# EAGLE design NinjaPool-1J-171004 (EAGLE 6.6.0)
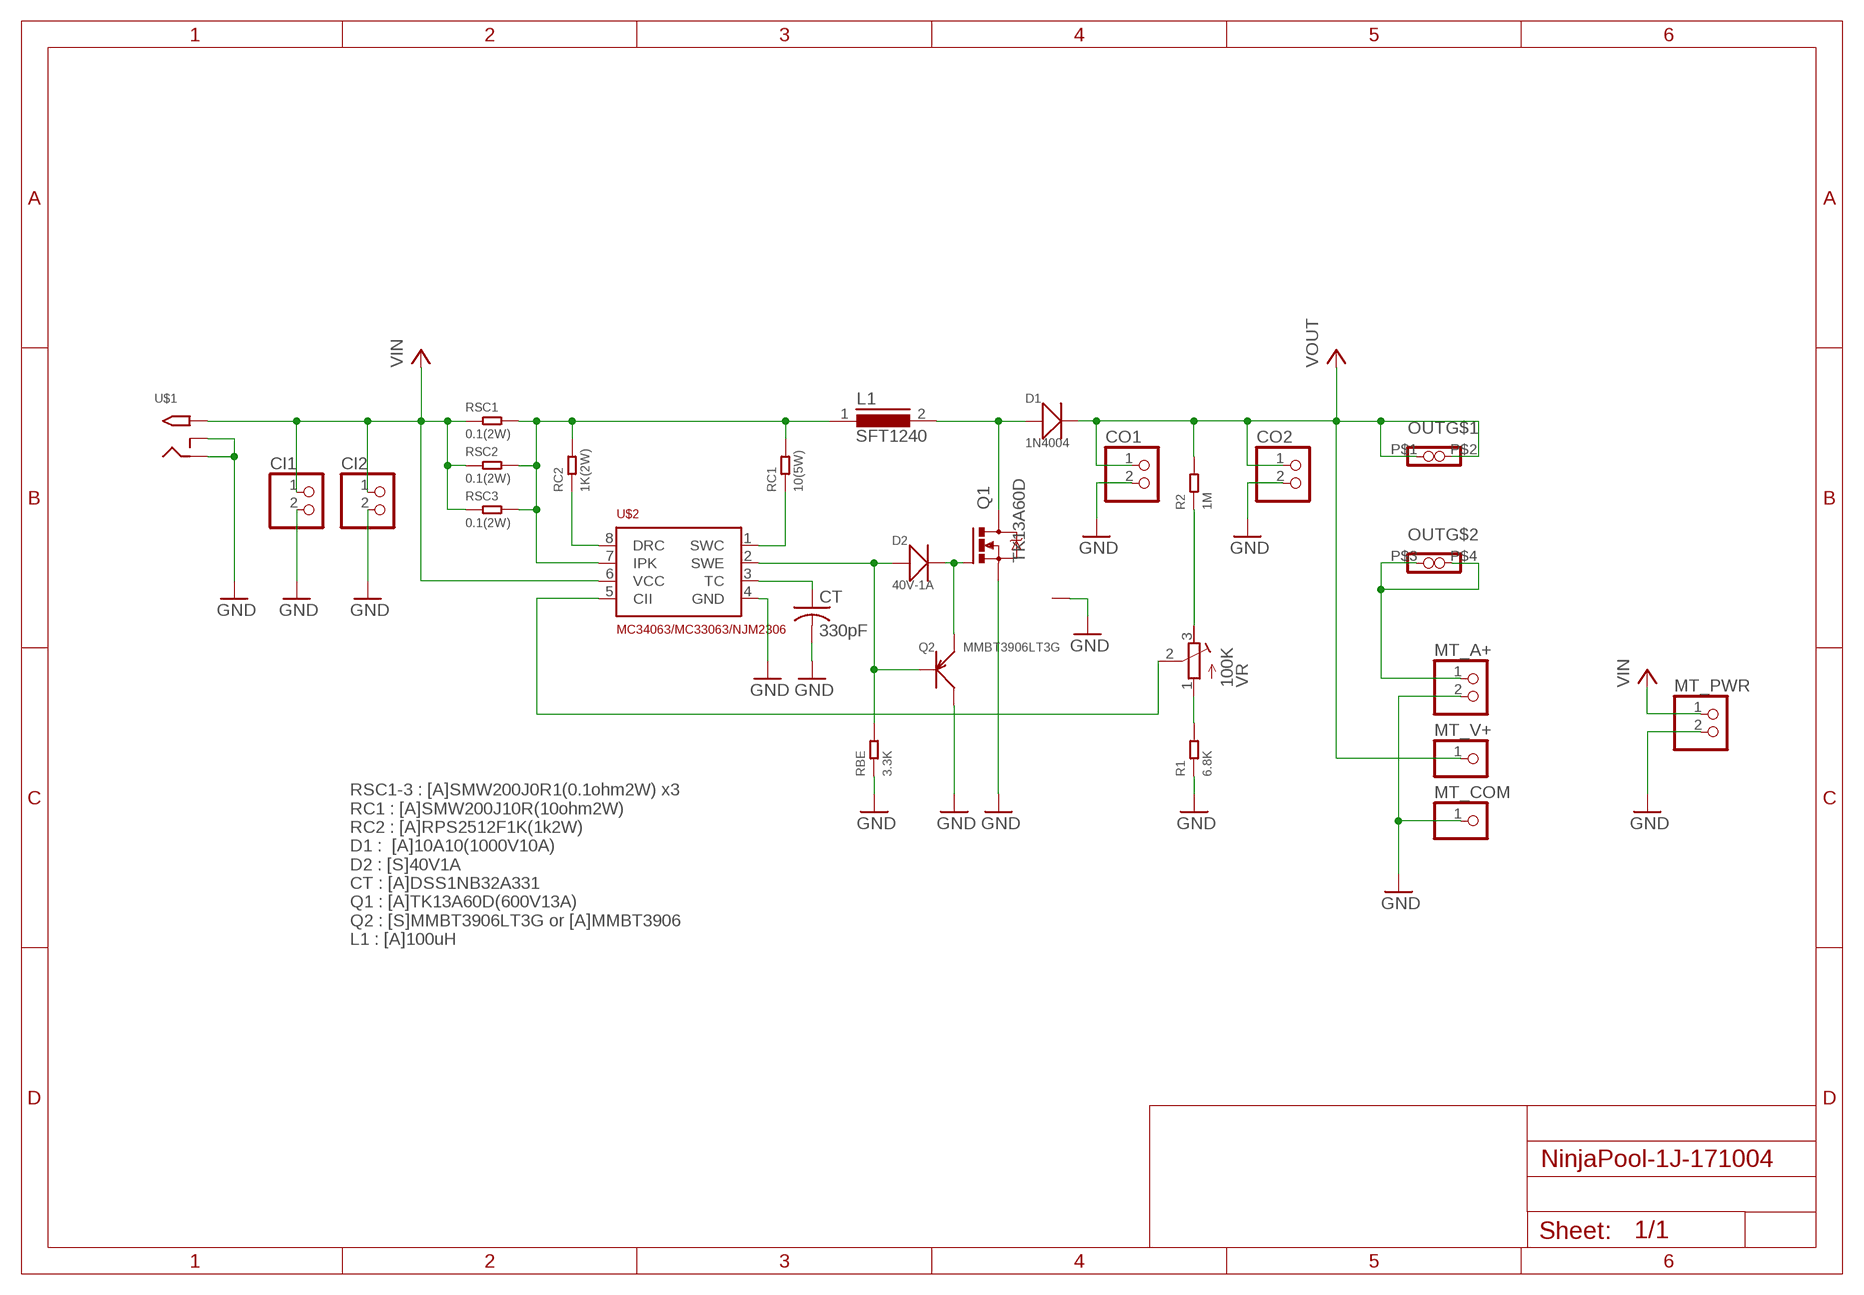
[diagram p0: schematic, sheet 1]

## Parts
CI1  PINHD-1X2  [1X02]
CI2  PINHD-1X2  [1X02]
CO1  PINHD-1X2  [1X02]
CO2  PINHD-1X2  [1X02]
CT  330pF  C-US050-024X044  [C050-024X044]
D1  1N4004  DIP-DIODE-400V-1A(DO-41)  [DO-41]
D2  40V-1A  SMD-DIODE-SCHOTTKY-40V-1A(DO-214AC)  [DO-214AC]
HEAT  HEAT111PB015  [HEAT11PB015]
L1  SFT1240  [SFT1240]
MT_A+  PINHD-1X2  [1X02]
MT_COM  PINHD-1X1  [1X01]
MT_PWR  PINHD-1X2  [1X02]
MT_V+  PINHD-1X1  [1X01]
OUT  BANANA  [BANANA_TMP]
Q1  TK13A60D  IRF520  [TO220BV]
Q2  MMBT3906LT3G  SMD-TRANSISTORS-PNP-40V-200MA-MMBT3906LT3G(SOT-23)  [SOT-23]
R1  6.8K  SMD-RES-6.8K-1%-1/10W(0603)  [R0603]
R2  1M  SMD-RES-1M-1%-1/10W(0603)  [R0603]
RBE  3.3K  SMD-RES-3.3K-5%-1/10W(0603)  [R0603]
RC1  10(5W)  SWE500  [SWE500]
RC2  1K(2W)  R2512  [R2512]
RSC1  0.1(2W)  SWE200  [SMW200]
RSC2  0.1(2W)  SWE200  [SMW200]
RSC3  0.1(2W)  SWE200  [SMW200]
U$1  2.1MMJACKTHM  [PJ-102A]
U$2  MC34063/MC33063/NJM2306  [DIL8]
VR  100K  R-TRIMMAITENDO_R16K1  [AITENDO_R16K1]

## Nets
A+: MT_A+.1 OUT.P$3 OUT.P$4
GND: CI1.2 CI2.2 CO1.2 CO2.2 CT.2 HEAT.P$1 MT_A+.2 MT_COM.1 MT_PWR.2 Q1.S Q2.3(C) R1.1 RBE.1 U$1.RING U$1.RING_SW U$2.4(GND)
LIN: L1.1 RC1.2 RC2.2 RSC1.2 RSC2.2 RSC3.2 U$2.7(IPK)
N$1: R2.1 VR.3(E)
N$2: RC2.1 U$2.8(DRC)
N$3: RC1.1 U$2.1(SWC)
N$4: CT.1 U$2.3(TC)
N$7: R1.2 VR.1(A)
N$8: U$2.5(CII) VR.2(S)
Q1_DRAIN: D1.1(+) L1.2 Q1.D
Q1_GATE_Q2_COLLECT: D2.2(-) Q1.G Q2.2(E)
Q2_BASE: D2.1(+) Q2.1(B) RBE.2 U$2.2(SWE)
VIN: CI1.1 CI2.1 MT_PWR.1 RSC1.1 RSC2.1 RSC3.1 U$1.TIP U$2.6(VCC)
VOUT: CO1.1 CO2.1 D1.2(-) MT_V+.1 OUT.P$1 OUT.P$2 R2.2

## Notes on the sheet
- RSC1-3 : [A]SMW200J0R1(0.1ohm2W) x3
  RC1 : [A]SMW200J10R(10ohm2W)
  RC2 : [A]RPS2512F1K(1k2W)
  D1 :  [A]10A10(1000V10A)
  D2 : [S]40V1A
  CT : [A]DSS1NB32A331
  Q1 : [A]TK13A60D(600V13A)
  Q2 : [S]MMBT3906LT3G or [A]MMBT3906
  L1 : [A]100uH

## Library data of the parts
CI1 CI2 CO1 CO2 MT_A+ MT_PWR = pinhead:PINHD-1X2: PIN HEADER
CT = rcl:C-US: CAPACITOR, American symbol
D1 = Seeed-Diode:DIP-DIODE-400V-1A(DO-41): 304010008; MPN: 1N4004
D2 = Seeed-Diode:SMD-DIODE-SCHOTTKY-40V-1A(DO-214AC): 304020027; MPN: 1N5819
HEAT = PCR-Connector:HEAT1
L1 = inductors:SFT1240: INDUCTOR
MT_COM MT_V+ = pinhead:PINHD-1X1: PIN HEADER
OUT = PCR-Connector:BANANA
Q1 = transistor-power:IRF520: HEXFET Power MOSFET
Q2 = Seeed-Transistor:SMD-TRANSISTORS-PNP-40V-200MA-MMBT3906LT3G(SOT-23): 305020002; MPN: MMBT3906LT3G
R1 = Seeed-Resistor:SMD-RES-6.8K-1%-1/10W(0603): 301010198; MPN: RC0805JR-07220KL
R2 = Seeed-Resistor:SMD-RES-1M-1%-1/10W(0603): 301010151; MPN: RC0603FR-071ML
RBE = Seeed-Resistor:SMD-RES-3.3K-5%-1/10W(0603): 301010112
RC1 RSC1-RSC3 = PCR-RCL:SWE
RC2 = PCR-RCL:R
U$1 = adafruit:2.1MMJACK: 2.1mm x 5.5mm THM DC jack with internal switch. Digikey part #PJ-102A, 4UCON part #05537 2.1mm x 5.5mm SMT DC jack with internal switch. Digikey part #PJ-002A-SMT, 4UCON part #03267 By microbuilder.eu & adafruit.com
U$2 = PCR-IC:MC34063/MC33063/NJM2306
VR = PCR-RCL:R-TRIMM

## Board
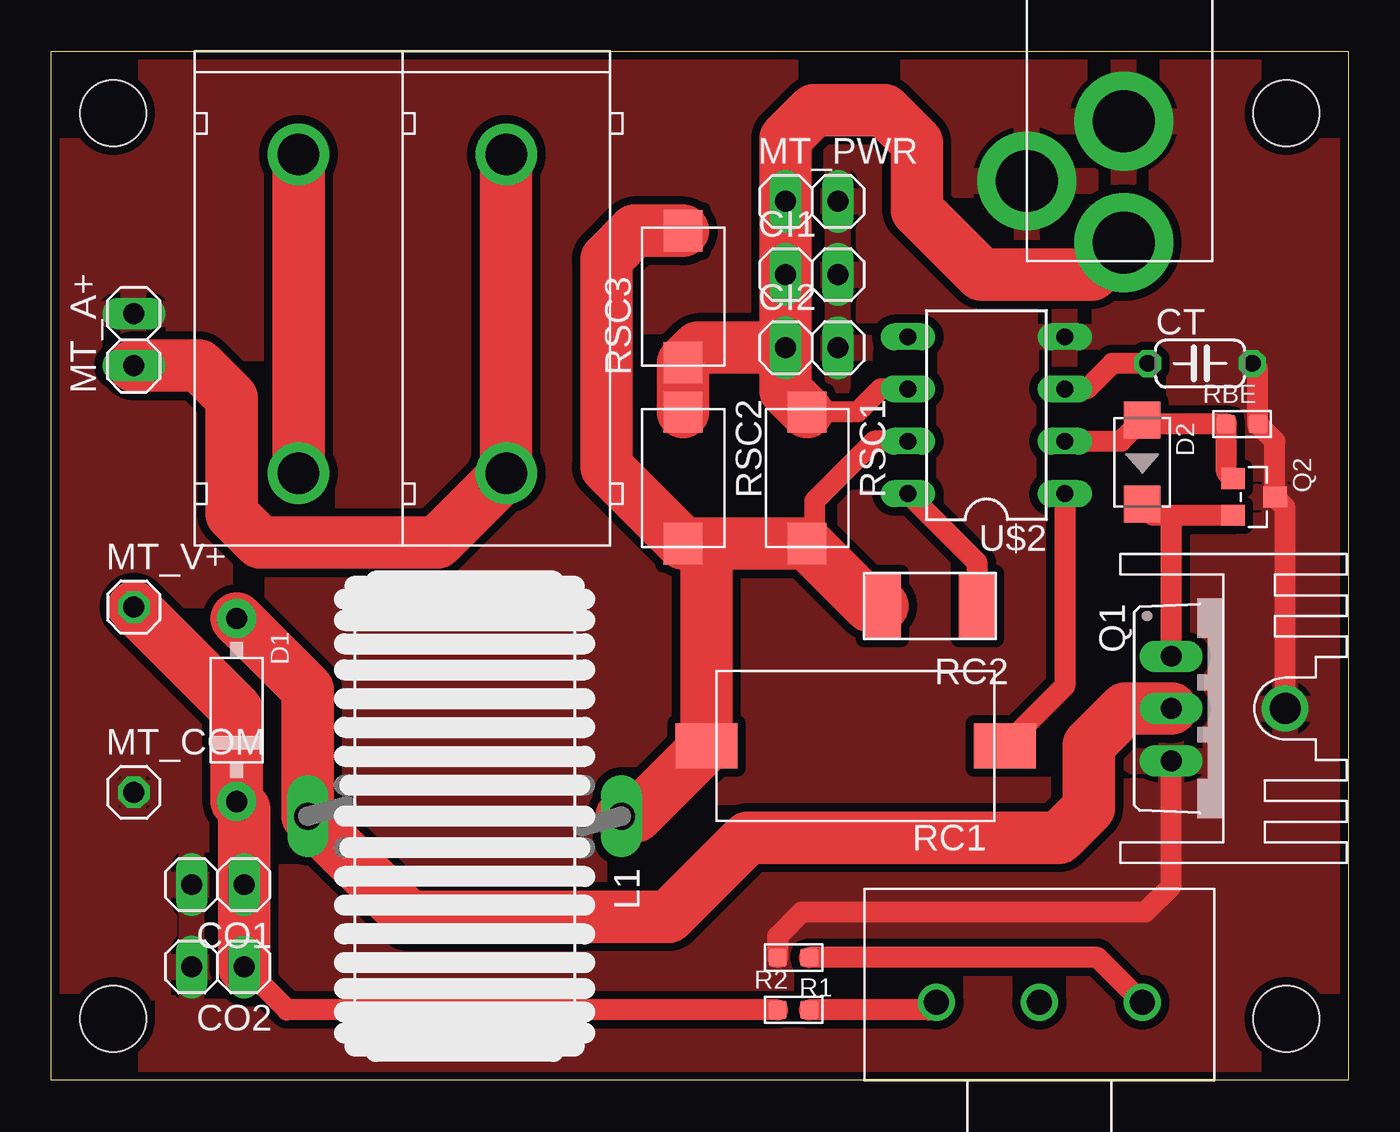
[diagram p1: board, top side]
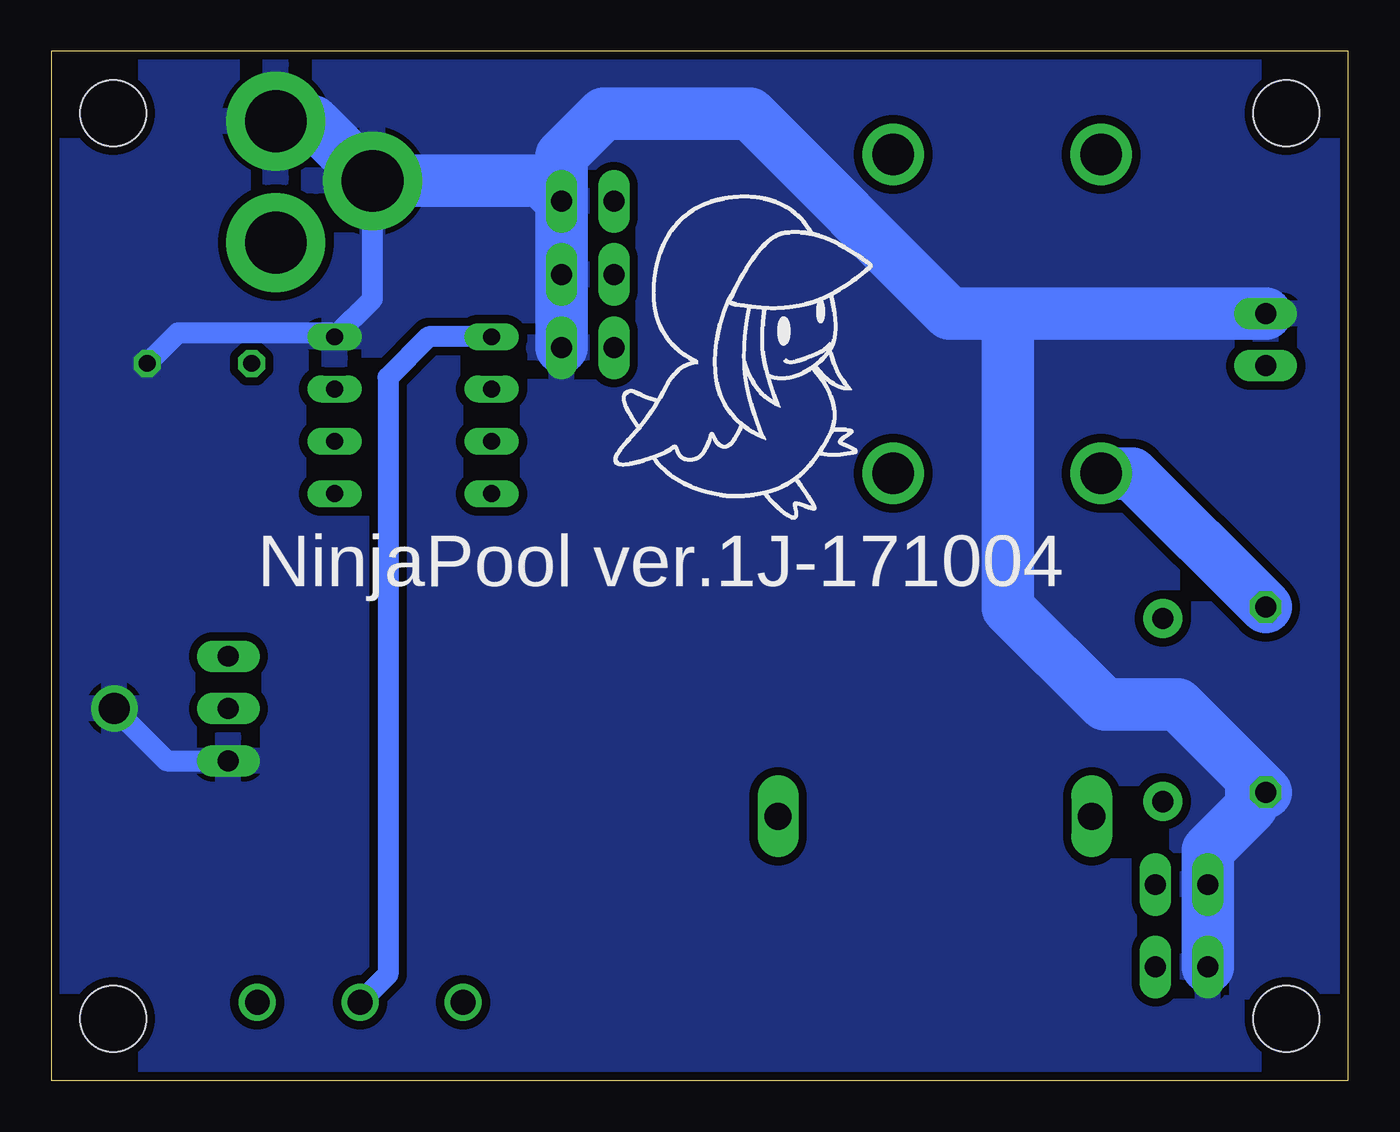
[diagram p2: board, bottom side, seen from below]

Size 63 x 50 mm. Coordinates in mm from the lower left corner, seen from the top.
Outline: 63,50 63,0 0,0 0,50 63,50
Copper layers (1*16): Top 0.035mm / dielectric 1.5mm / Bottom 0.035mm
Design rules "SeeedStudio_2layer_DRU_no_angle_20140221": minimum track width 6mil, minimum drill 12mil, track to track 6mil, track to pad 6mil, pad to pad 6mil, via to via 6mil, smd to smd 0mil, copper to edge 10mil, drill to drill 10mil, minimum pad ring 10mil, minimum via ring 6mil, stop-mask expansion 2mil, vias tented up to drill 100mil, thermal gap 10mil
Holes 3.2 mm at 3,3 60,3 60,47 3,47

### Footprints (pad centres in the part's own frame; a part is rotated, then mirrored left to right if it is on the bottom)
1X02 = drill 1.016 long: 1 -1.27,0; 2 1.27,0
C050-024X044 = drill 0.813 octagon: 1 -2.54,0; 2 2.54,0
DO-41 = drill 1.041 pad 1.905: 1 -4.445,0; 2 4.445,0
DO-214AC = smd 1.8 x 1.77: 1 -2.042,0; 2 2.042,0
HEAT11PB015 = drill 1.5: P$1 0,3
SFT1240 = drill 1.321 long: 1 -7.62,0; 2 7.62,0
1X01 = drill 1.016 octagon: 1 0,0
BANANA_TMP = drill 2: P$1 0,20.5; P$2 0,5; P$3 -10.1,20.5; P$4 -10.1,5
TO220BV = drill 1.016 long: D 0,-2.54; G -2.54,-2.54; S 2.54,-2.54
SOT-23 = smd 1.016 x 1.143: 1 -0.889,-1.016; 2 0.889,-1.016; 3 0,1.016
R0603 = smd 0.889 x 0.889: 1 0,0.762; 2 0,-0.762
SWE500 = smd 3 x 2.2: 1 -7.25,0; 2 7.25,0
R2512 = smd 1.8 x 3.2: 1 -2.3,0; 2 2.3,0
SMW200 = smd 2 x 1.9: 1 -3.2,0; 2 3.2,0
PJ-102A = drill 3 pad 4.8: RING 0.1,-3.39; RING_SW -4.6,-6.29; TIP 0.1,-9.29
DIL8 = drill 0.813 long: 1 -3.81,-3.81; 2 -1.27,-3.81; 3 1.27,-3.81; 4 3.81,-3.81; 5 3.81,3.81; 6 1.27,3.81; 7 -1.27,3.81; 8 -3.81,3.81
AITENDO_R16K1 = drill 1.2: 1 -5,0; 2 0,0; 3 5,0

### Placement (x,y rotation side)
CI1  36.94,39.16 0 top
CI2  36.94,35.6 0 top
CO1  8.09,9.52 180 top
CO2  8.09,5.52 180 top
CT  55.81,34.84 0 top
D1  9,18 270 top
D2  53,30.04 270 top
HEAT  56.94,18.07 270 top
L1  20.08,12.83 180 top
MT_A+  4,36 90 top
MT_COM  4,14 0 top
MT_PWR  36.94,42.72 0 top
MT_V+  4,23 0 top
OUT  12,50 180 top
Q1  56.94,18.07 270 top
Q2  58.43,28.35 270 top
R1  36.05,5.97 90 top
R2  36.05,3.43 270 top
RBE  57.85,31.9 270 top
RC1  39.07,16.25 180 top
RC2  42.69,23.06 180 top
RSC1  36.72,29.28 270 top
RSC2  30.69,29.28 270 top
RSC3  30.69,38.08 90 top
U$1  52,50 0 top
U$2  45.43,32.33 90 top
U$3  [TORI_0.5]  36,27 0 bottom
VR  48,3.8 180 top

### Tracks (layer width: path | path; a pad name or v marks a point on that pad's centre or on a via)
A+
  Top 2.54: OUT.P$4 OUT.P$3 18.74,26.14 10.15,26.14 8.75,27.53 8.75,33.15 7.17,34.73 MT_A+.1
GND
  Top 1.016: CT.2 58.61,34.58 RBE.1 59.44,31.06 Q2.3 59.94,27.85 HEAT.P$1 | R1.1 35.29,7.01 36.46,8.18 53.15,8.18 54.4,9.43 Q1.S
  Bottom 1.016: U$1.RING_SW 47.4,37.98 U$2.4 49.42,36.32 56.87,36.32 CT.2 | HEAT.P$1 57.4,15.53 Q1.S
  Bottom 2.54: U$1.RING 50.3,46.61 U$1.RING_SW 39.21,43.71 MT_PWR.2 | MT_PWR.2 CI1.2 CI2.2 | CO2.2 CO1.2 6.82,11.18 4.71,13.28 4.71,14 MT_COM.1 8.26,18.26 11.82,18.26 16.52,22.96 16.52,37.27 | MT_PWR.2 38.22,44.93 36.18,46.97 29.07,46.97 19.38,37.27 16.52,37.27 | MT_A+.2 16.52,37.27
  pour Bottom (isolate 0.406): -1,51 64,51 64,-1 -1,-1
  pour Top (isolate 0.406): -2,52 65,52 65,-2 -2,-2
LIN
  Top 1.016: U$2.7 39.98,31.06 37.08,28.15 37.08,25.71
  Top 2.54: RSC3.2 28.34,41.28 26.96,39.9 26.96,29.81 RSC2.2 31.64,26.08 | 31.64,26.08 RSC1.2 37.08,25.71 39.74,23.06 RC2.2 | 31.64,26.08 31.82,25.89 RC1.2 28.41,12.84 L1.1
N$1
  Top 1.016: VR.3 42.63,3.43 R2.1
N$2
  Top 1.016: RC2.1 44.98,25.15 U$2.8
N$3
  Top 1.016: U$2.1 49.24,19.16 RC1.1
N$4
  Top 1.016: CT.1 51.54,34.84 50.3,33.6 U$2.3
N$7
  Top 1.016: VR.1 50.83,5.97 R1.2
N$8
  Bottom 1.016: U$2.5 44.67,36.14 46.65,34.16 46.65,5.15 VR.2
Q1_DRAIN
  Top 2.54: D1.1 12.46,18.99 L1.2 17.34,7.95 29.98,7.95 33.82,11.79 48.96,11.79 50.41,13.23 50.41,16.31 52.17,18.07 Q1.D
Q1_GATE_Q2_COLLECT
  Top 1.016: Q2.2 54.27,27.46 | 54.27,27.46 53.54,27.46 D2.2 | Q1.G 54.4,27.32 54.27,27.46
Q2_BASE
  Top 1.016: Q2.1 57.09,29.56 RBE.2 53.19,31.89 D2.1 51.97,31.06 U$2.2
VIN
  Top 1.016: U$2.6 40.29,33.6 39.17,32.48 RSC1.1
  Top 2.54: U$1.TIP 50.56,39.17 45.17,39.17 42.05,42.29 42.05,45.57 40.48,47.14 37.05,47.14 35.67,45.77 MT_PWR.1 CI1.1 CI2.1 | CI2.1 35.67,33.52 RSC1.1 | CI2.1 31.42,35.6 RSC3.1 RSC2.1
VOUT
  Top 1.016: R2.2 11.44,3.43 CO2.1
  Top 2.54: CO2.1 CO1.1 9.36,13.2 D1.2 9,18 MT_V+.1 | OUT.P$1 OUT.P$2
  Bottom 2.54: MT_V+.1 10.5,29.5 OUT.P$1

### Text on the board
bPlace: NinjaPool ver.1J-171004